# EAGLE schematic base (EAGLE 9.4.1)
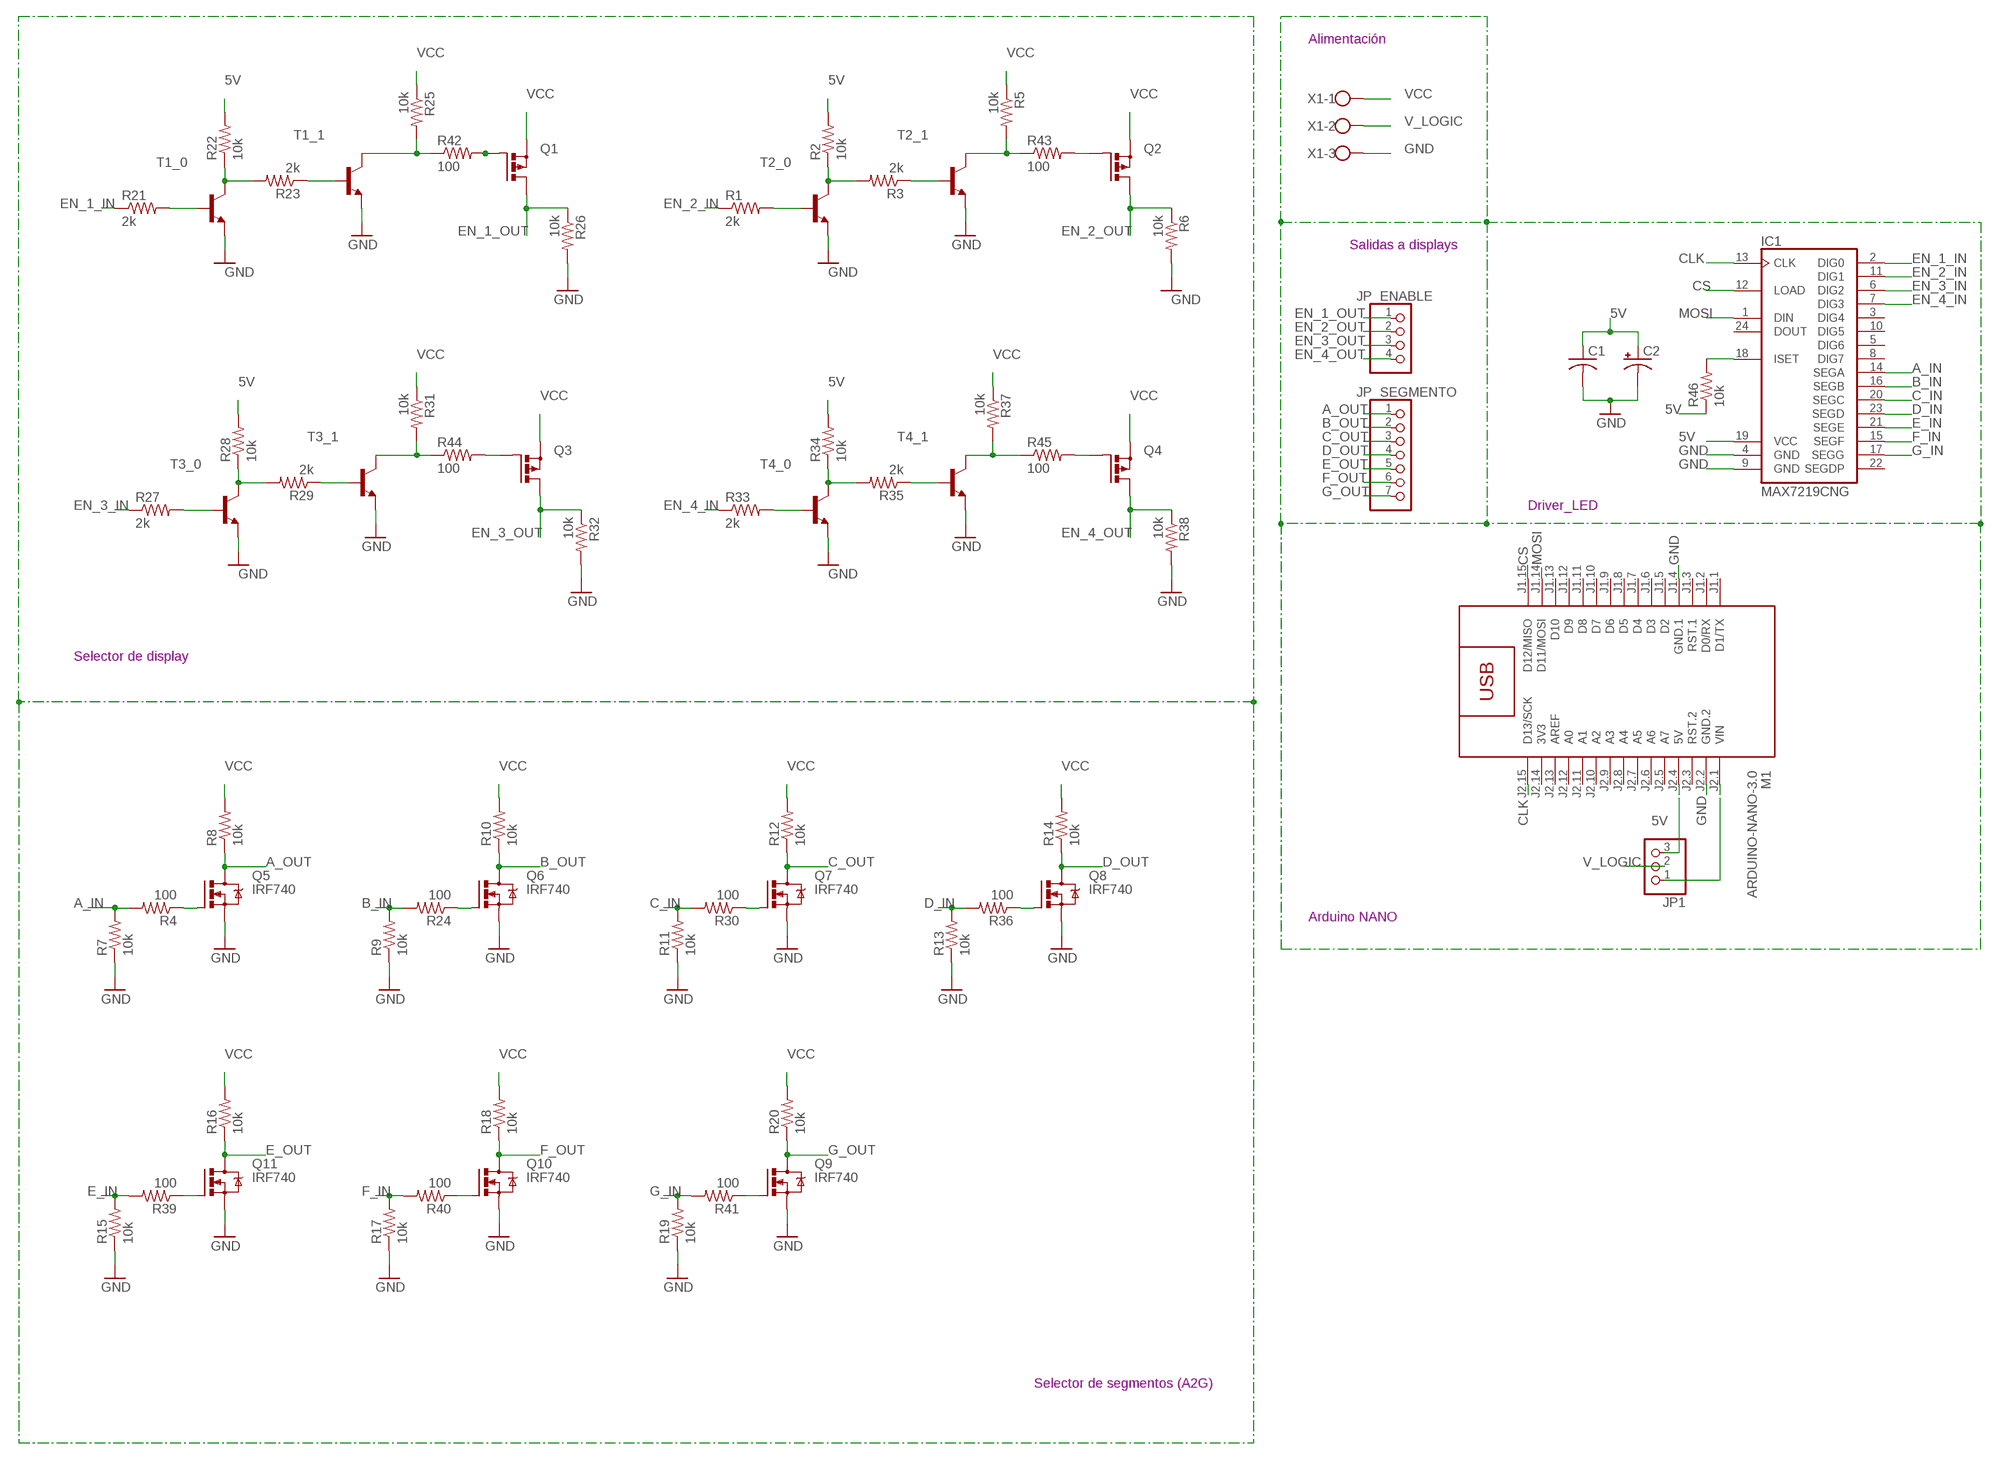
[diagram p0: schematic, sheet 1]

## Parts
C1  C-US025-030X050  [C025-030X050]
C2  CPOL-USE2.5-5  [E2,5-5]
IC1  MAX7219CNG  [DIL24-3]
JP1  PINHD-1X3  [1X03]
JP_ENABLE  PINHD-1X4  [1X04]
JP_SEGMENTO  PINHD-1X7  [1X07]
M1  ARDUINO-NANO-3.0  [ARDUINO-NANO-3.0]
Q1  PMOSFET_PTO220BV  [TO220BV]
Q2  PMOSFET_PTO220BV  [TO220BV]
Q3  PMOSFET_PTO220BV  [TO220BV]
Q4  PMOSFET_PTO220BV  [TO220BV]
Q5  IRF740  [TO220BV]
Q6  IRF740  [TO220BV]
Q7  IRF740  [TO220BV]
Q8  IRF740  [TO220BV]
Q9  IRF740  [TO220BV]
Q10  IRF740  [TO220BV]
Q11  IRF740  [TO220BV]
R1  2k  R-US_0207/10  [0207/10]
R2  10k  R-US_0207/10  [0207/10]
R3  2k  R-US_0207/10  [0207/10]
R4  100  R-US_0207/10  [0207/10]
R5  10k  R-US_0207/10  [0207/10]
R6  10k  R-US_0207/10  [0207/10]
R7  10k  R-US_0207/10  [0207/10]
R8  10k  R-US_0207/10  [0207/10]
R9  10k  R-US_0207/10  [0207/10]
R10  10k  R-US_0207/10  [0207/10]
R11  10k  R-US_0207/10  [0207/10]
R12  10k  R-US_0207/10  [0207/10]
R13  10k  R-US_0207/10  [0207/10]
R14  10k  R-US_0207/10  [0207/10]
R15  10k  R-US_0207/10  [0207/10]
R16  10k  R-US_0207/10  [0207/10]
R17  10k  R-US_0207/10  [0207/10]
R18  10k  R-US_0207/10  [0207/10]
R19  10k  R-US_0207/10  [0207/10]
R20  10k  R-US_0207/10  [0207/10]
R21  2k  R-US_0207/10  [0207/10]
R22  10k  R-US_0207/10  [0207/10]
R23  2k  R-US_0207/10  [0207/10]
R24  100  R-US_0207/10  [0207/10]
R25  10k  R-US_0207/10  [0207/10]
R26  10k  R-US_0207/10  [0207/10]
R27  2k  R-US_0207/10  [0207/10]
R28  10k  R-US_0207/10  [0207/10]
R29  2k  R-US_0207/10  [0207/10]
R30  100  R-US_0207/10  [0207/10]
R31  10k  R-US_0207/10  [0207/10]
R32  10k  R-US_0207/10  [0207/10]
R33  2k  R-US_0207/10  [0207/10]
R34  10k  R-US_0207/10  [0207/10]
R35  2k  R-US_0207/10  [0207/10]
R36  100  R-US_0207/10  [0207/10]
R37  10k  R-US_0207/10  [0207/10]
R38  10k  R-US_0207/10  [0207/10]
R39  100  R-US_0207/10  [0207/10]
R40  100  R-US_0207/10  [0207/10]
R41  100  R-US_0207/10  [0207/10]
R42  100  R-US_0207/10  [0207/10]
R43  100  R-US_0207/10  [0207/10]
R44  100  R-US_0207/10  [0207/10]
R45  100  R-US_0207/10  [0207/10]
R46  10k  R-US_0207/10  [0207/10]
T1_0  2N2222-NPN-TO92-EBC  [TO92-EBC]
T1_1  2N2222-NPN-TO92-EBC  [TO92-EBC]
T2_0  2N2222-NPN-TO92-EBC  [TO92-EBC]
T2_1  2N2222-NPN-TO92-EBC  [TO92-EBC]
T3_0  2N2222-NPN-TO92-EBC  [TO92-EBC]
T3_1  2N2222-NPN-TO92-EBC  [TO92-EBC]
T4_0  2N2222-NPN-TO92-EBC  [TO92-EBC]
T4_1  2N2222-NPN-TO92-EBC  [TO92-EBC]
X1  W237-103  [W237-103]

## Nets
5V: C1.1 C2.+ IC1.19(VCC) JP1.3 M1.J2.4(5V) R2.2 R22.2 R28.2 R34.2 R46.1
A_IN: IC1.14(SEGA) R4.2 R7.2
A_OUT: JP_SEGMENTO.1 Q5.D R8.1
B_IN: IC1.16(SEGB) R9.2 R24.2
B_OUT: JP_SEGMENTO.2 Q6.D R10.1
C_IN: IC1.20(SEGC) R11.2 R30.2
C_OUT: JP_SEGMENTO.3 Q7.D R12.1
CLK: IC1.13(CLK) M1.J2.15(D13/SCK)
CS: IC1.12(LOAD) M1.J1.15(D12/MISO)
D_IN: IC1.23(SEGD) R13.2 R36.2
D_OUT: JP_SEGMENTO.4 Q8.D R14.1
E_IN: IC1.21(SEGE) R15.2 R39.2
E_OUT: JP_SEGMENTO.5 Q11.D R16.1
EN_1_IN: IC1.2(DIG0) R21.1
EN_1_OUT: JP_ENABLE.1 Q1.D R26.1
EN_2_IN: IC1.11(DIG1) R1.1
EN_2_OUT: JP_ENABLE.2 Q2.D R6.1
EN_3_IN: IC1.6(DIG2) R27.1
EN_3_OUT: JP_ENABLE.3 Q3.D R32.1
EN_4_IN: IC1.7(DIG3) R33.1
EN_4_OUT: JP_ENABLE.4 Q4.D R38.1
F_IN: IC1.15(SEGF) R17.2 R40.2
F_OUT: JP_SEGMENTO.6 Q10.D R18.1
G_IN: IC1.17(SEGG) R19.2 R41.2
G_OUT: JP_SEGMENTO.7 Q9.D R20.1
GND: C1.2 C2.- IC1.4(GND) IC1.9(GND) M1.J1.4(GND.1) M1.J2.2(GND.2) Q5.S Q6.S Q7.S Q8.S Q9.S Q10.S Q11.S R6.2 R7.1 R9.1 R11.1 R13.1 R15.1 R17.1 R19.1 R26.2 R32.2 R38.2 T1_0.E T1_1.E T2_0.E T2_1.E T3_0.E T3_1.E T4_0.E T4_1.E X1.3
MOSI: IC1.1(DIN) M1.J1.14(D11/MOSI)
N$1: R1.2 T2_0.B
N$2: R2.1 R3.2 T2_0.C
N$3: R3.1 T2_1.B
N$4: R5.2 R43.1 T2_1.C
N$5: Q5.G R4.1
N$6: Q6.G R24.1
N$7: Q7.G R30.1
N$8: Q8.G R36.1
N$9: Q1.G R42.2
N$10: Q10.G R40.1
N$11: Q9.G R41.1
N$12: Q2.G R43.2
N$13: Q3.G R44.2
N$14: Q4.G R45.2
N$15: IC1.18(ISET) R46.2
N$16: Q11.G R39.1
N$21: JP1.1 M1.J2.1(VIN)
N$29: R21.2 T1_0.B
N$30: R22.1 R23.2 T1_0.C
N$31: R23.1 T1_1.B
N$32: R25.2 R42.1 T1_1.C
N$36: R27.2 T3_0.B
N$37: R28.1 R29.2 T3_0.C
N$38: R29.1 T3_1.B
N$39: R31.2 R44.1 T3_1.C
N$43: R33.2 T4_0.B
N$44: R34.1 R35.2 T4_0.C
N$45: R35.1 T4_1.B
N$46: R37.2 R45.1 T4_1.C
V_LOGIC: JP1.2 X1.2
VCC: Q1.S Q2.S Q3.S Q4.S R5.1 R8.2 R10.2 R12.2 R14.2 R16.2 R18.2 R20.2 R25.1 R31.1 R37.1 X1.1
Unconnected: IC1.3(DIG4) IC1.5(DIG6) IC1.8(DIG7) IC1.10(DIG5) IC1.22(SEGDP) IC1.24(DOUT) M1.J1.1(D1/TX) M1.J1.2(D0/RX) M1.J1.3(RST.1) M1.J1.5(D2) M1.J1.6(D3) M1.J1.7(D4) M1.J1.8(D5) M1.J1.9(D6) M1.J1.10(D7) M1.J1.11(D8) M1.J1.12(D9) M1.J1.13(D10) M1.J2.3(RST.2) M1.J2.5(A7) M1.J2.6(A6) M1.J2.7(A5) M1.J2.8(A4) M1.J2.9(A3) M1.J2.10(A2) M1.J2.11(A1) M1.J2.12(A0) M1.J2.13(AREF)

## Notes on the sheet
- Alimentación
- Salidas a displays
- Driver_LED
- Selector de display
- Arduino NANO
- Selector de segmentos (A2G)

## Power pins joined to a net without a drawn wire
3V3: M1.J2.14(3V3)

## Library data of the parts
C1 = rcl:C-US: CAPACITOR, American symbol
C2 = rcl:CPOL-US: POLARIZED CAPACITOR, American symbol
IC1 = maxim:MAX7219CNG: LED DISPLAY DRIVER; MF: MAXIM; MPN: MAX7219CNG; OC_FARNELL: 1523914; OC_NEWARK: 34C4018
JP1 = pinhead:PINHD-1X3: PIN HEADER
JP_ENABLE = pinhead:PINHD-1X4: PIN HEADER
JP_SEGMENTO = pinhead:PINHD-1X7: PIN HEADER
M1 = diy-modules:ARDUINO-NANO-3.0: Arduino Nano 3.0 and compatible devices More details available here: https://www.arduino.cc/en/Main/ArduinoBoardNano Click here to find device on ebay.com <http://www.ebay.com/sch/arduino+nano>
Q1-Q4 = transistor-power:PMOSFET_P: Power MOSFET P-Channel
Q5-Q11 = transistor-power:IRF740: N-CHANNEL MOS FET
R1-R46 = rcl:R-US_: RESISTOR, American symbol
T1_0 T1_1 T2_0 T2_1 T3_0 T3_1 T4_0 T4_1 = transistor-neu-to92:*-NPN-: NPN Transistror
X1 = con-wago-500:W237-103: WAGO SCREW CLAMP; MPN: 237-103; OC_FARNELL: unknown; OC_NEWARK: 18M7116